# EAGLE schematic Differential driver (EAGLE 7.6.0)
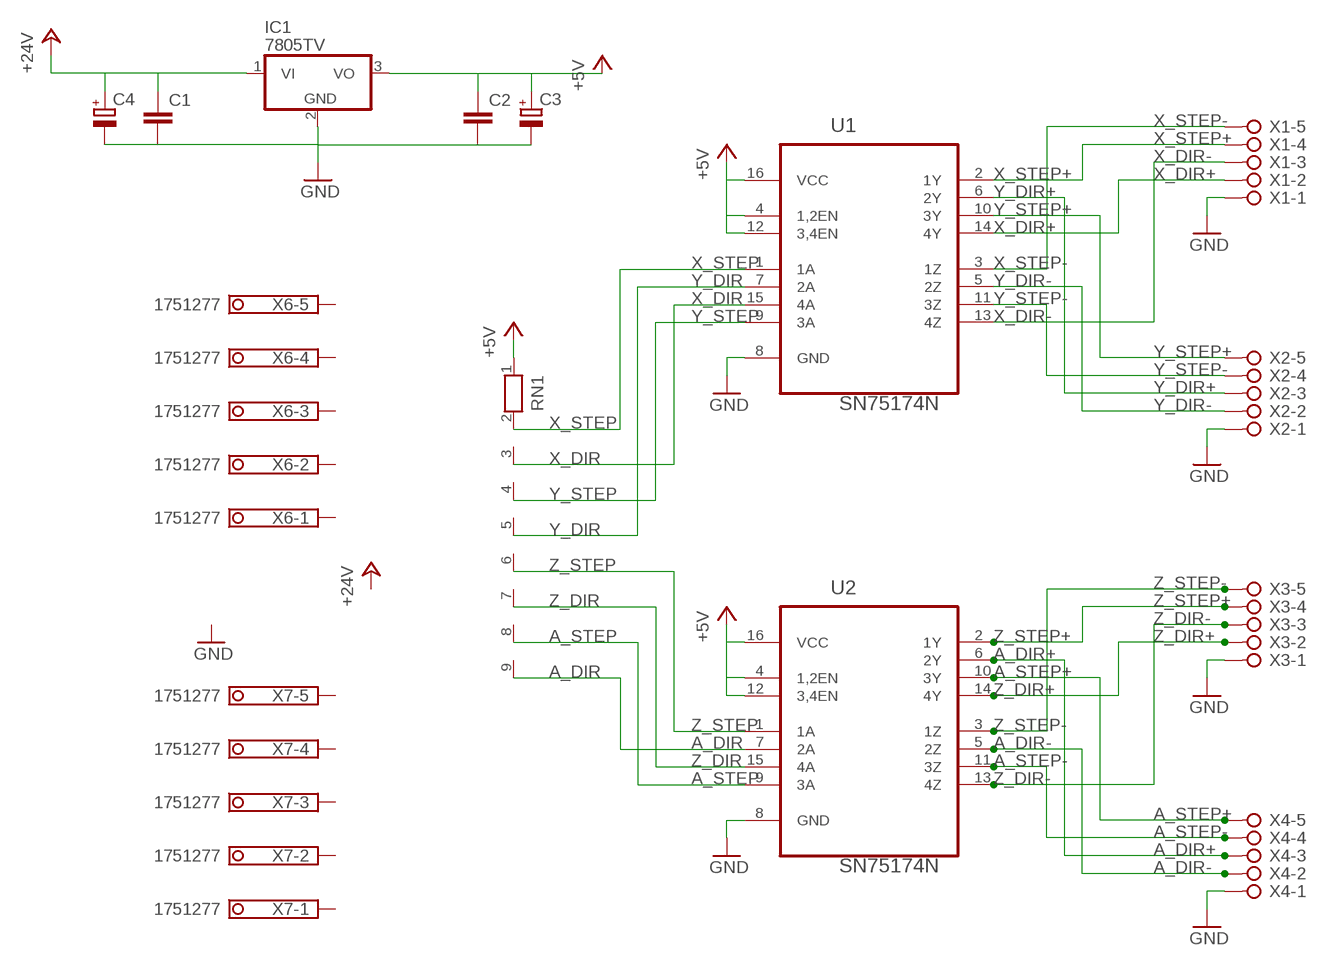
[diagram p0: schematic, sheet 1]

## Parts
C1  C-EU025-025X050  [C025-025X050]
C2  C-EU025-025X050  [C025-025X050]
C3  CPOL-EUE2.5-5  [E2,5-5]
C4  CPOL-EUE2.5-5  [E2,5-5]
IC1  7805TV  [TO220V]
RN1  RN08  [RN-9]
U1  SN75174N  [DIP254P762X508-16]
U2  SN75174N  [DIP254P762X508-16]
X1  W237-05P  [W237-5P]
X2  W237-05P  [W237-5P]
X3  W237-05P  [W237-5P]
X4  W237-05P  [W237-5P]
X6  1751277  [1751277]
X7  1751277  [1751277]

## Nets
+5V: C2.1 C3.+ IC1.3(VO) RN1.1 U1.4(1,2EN) U1.12(3,4EN) U1.16(VCC) U2.4(1,2EN) U2.12(3,4EN) U2.16(VCC)
+24V: C1.1 C4.+ IC1.1(VI)
A_DIR: RN1.9 U2.7(2A)
A_DIR+: U2.6(2Y) X4.3
A_DIR-: U2.5(2Z) X4.2
A_STEP: RN1.8 U2.9(3A)
A_STEP+: U2.10(3Y) X4.5
A_STEP-: U2.11(3Z) X4.4
GND: C1.2 C2.2 C3.- C4.- IC1.2(GND) U1.8(GND) U2.8(GND) X1.1 X2.1 X3.1 X4.1
X_DIR: RN1.3 U1.15(4A)
X_DIR+: U1.14(4Y) X1.2
X_DIR-: U1.13(4Z) X1.3
X_STEP: RN1.2 U1.1(1A)
X_STEP+: U1.2(1Y) X1.4
X_STEP-: U1.3(1Z) X1.5
Y_DIR: RN1.5 U1.7(2A)
Y_DIR+: U1.6(2Y) X2.3
Y_DIR-: U1.5(2Z) X2.2
Y_STEP: RN1.4 U1.9(3A)
Y_STEP+: U1.10(3Y) X2.5
Y_STEP-: U1.11(3Z) X2.4
Z_DIR: RN1.7 U2.15(4A)
Z_DIR+: U2.14(4Y) X3.2
Z_DIR-: U2.13(4Z) X3.3
Z_STEP: RN1.6 U2.1(1A)
Z_STEP+: U2.2(1Y) X3.4
Z_STEP-: U2.3(1Z) X3.5
Unconnected: X6.1 X6.2 X6.3 X6.4 X6.5 X7.1 X7.2 X7.3 X7.4 X7.5

## Library data of the parts
C1 C2 = rcl:C-EU: CAPACITOR, European symbol
C3 C4 = rcl:CPOL-EU: POLARIZED CAPACITOR, European symbol
IC1 = linear:78*: Positive VOLTAGE REGULATOR Source: http://cache.national.com/ds/LM/LM78L05.pdf http://www.fairchildsemi.com/ds/LM/LM7805.pdf
RN1 = resistor-net:RN08: RESISTOR NETWORK; OC_FARNELL: unknown; OC_NEWARK: unknown
U1 U2 = Texas Instruments_By_element14_Batch_1:SN75174N: QUADRUPLE DIFFERENTIAL LINE DRIVER; MPN: SN75174N; OC_FARNELL: 1106026; OC_NEWARK: 60K6927; PACKAGE: PDIP-16; SUPPLIER: Texas Instruments
X1-X4 = con-wago-508:W237-05P: WAGO SREW CLAMP; OC_FARNELL: unknown; OC_NEWARK: unknown
X6 X7 = con-phoenix-350:1751277: MKDS 1/ 5-3,5 Printklemme Nennstrom: 10 A Bemessungsspannung: 160 V Raster: 3,5 mm Polzahl: 5 Montageart: Löten Anschlussart: Schraubanschluss Anschlussrichtung vom Leiter zur Platine: 0° Source: http://eshop.phoenixcontact.com .. 1751277.pdf; OC_FARNELL: unknown; OC_NEWARK: unknown